# Altium schematic sheet com.SchDoc
size A4
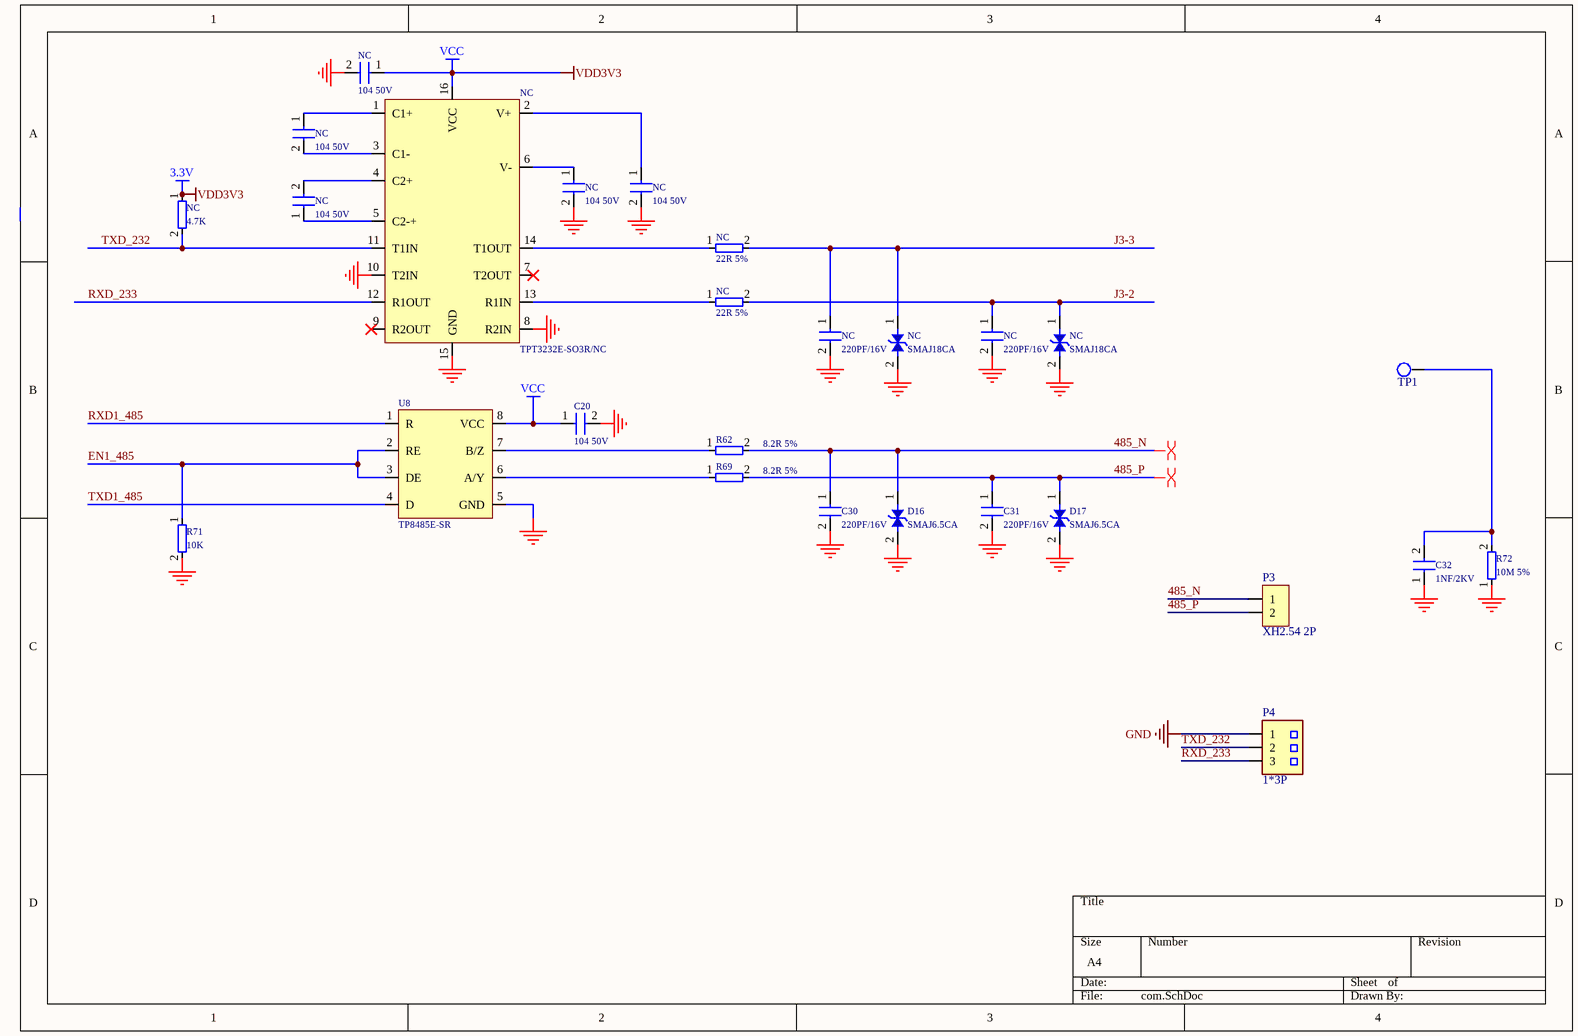
[diagram p0: com.SchDoc]

## Parts
(Parts that share a designator on the sheet are numbered #1, #2 ... from top to bottom, then left to right.)
C20  104 50V  [0603C]
C30  220PF/16V  [0603C]
C31  220PF/16V  [0603C]
C32  1NF/2KV  [1206C]
D16  SMAJ6.5CA  [SMA]
D17  SMAJ6.5CA  [SMA]
NC#1  104 50V  [0603C]
NC#2  TPT3232E-SO3R/NC  [SO-16Z]
NC#3  104 50V  [0603C]
NC#4  104 50V  [0603C]
NC#5  104 50V  [0603C]
NC#6  104 50V  [0603C]
NC#7  4.7K  [0603R]
NC#8  22R 5%  [0603R]
NC#9  22R 5%  [0603R]
NC#10  SMAJ18CA  [SMA]
NC#11  SMAJ18CA  [SMA]
NC#12  220PF/16V  [0603C]
NC#13  220PF/16V  [0603C]
P3  XH2.54 2P  [SIP-2A]
P4  1*3P  [3X2.54MMZ2]
R62  8.2R 5%  [0603R]
R69  8.2R 5%  [0603R]
R71  10K  [0603R]
R72  10M 5%  [1206r]
TP1  TPS  [tpd]  (value not drawn)
U8  TP8485E-SR  [SO-8]

## Nets
3.3V: C20.1 NC#1.1 NC#2.16(VCC) NC#7.1 U8.8(VCC)  [also labelled VCC, VDD3V3]
GND: C20.2 C30.2 C31.2 C32.1 D16.2 D17.2 NC#1.2 NC#2.8(R2IN) NC#2.10(T2IN) NC#2.15(GND) NC#5.2 NC#6.2 NC#10.2 NC#11.2 NC#12.2 NC#13.2 P4.1 R71.2 R72.1 U8.5(GND)
485_N: C30.1 D16.1 P3.1 R62.2
485_P: C31.1 D17.1 P3.2 R69.2
EN1_485: R71.1 U8.2(RE) U8.3(DE)
J3-2: NC#9.2 NC#11.1 NC#13.1
J3-3: NC#8.2 NC#10.1 NC#12.1
RXD1_485: U8.1(R)
RXD_233: NC#2.12(R1OUT) P4.3
TXD1_485: U8.4(D)
TXD_232: NC#2.11(T1IN) NC#7.2 P4.2
NetC32_2: C32.2 R72.2 TP1.1
NetNC#2_1: NC#2.1(C1+) NC#3.1
NetNC#2_2: NC#2.2(V+) NC#6.1
NetNC#2_3: NC#2.3(C1-) NC#3.2
NetNC#2_4: NC#2.4(C2+) NC#4.2
NetNC#2_5: NC#2.5(C2-+) NC#4.1
NetNC#2_6: NC#2.6(V-) NC#5.1
NetNC#2_13: NC#2.13(R1IN) NC#9.1
NetNC#2_14: NC#2.14(T1OUT) NC#8.1
NetR62_1: R62.1 U8.7(B/Z)
NetR69_1: R69.1 U8.6(A/Y)

Not connected (* = marked no-connect by the designer): NC#2 7(T2OUT)* 9(R2OUT)*

## Layout directives
differential pair: 485_N, 485_P

## Library data of the parts
C20 C30-C32 NC#1 NC#3-NC#6 NC#12 NC#13 = CAP
D16 D17 NC#10 NC#11 = D_ESD
NC#2 = TPT3232E-SO3R
NC#7-NC#9 R62 R69 R71 R72 = RES
P3 = SIP-2: XH2.54 2P 直插
P4 = HDR1*3